# EAGLE design platine_controller (EAGLE 9.6.2)
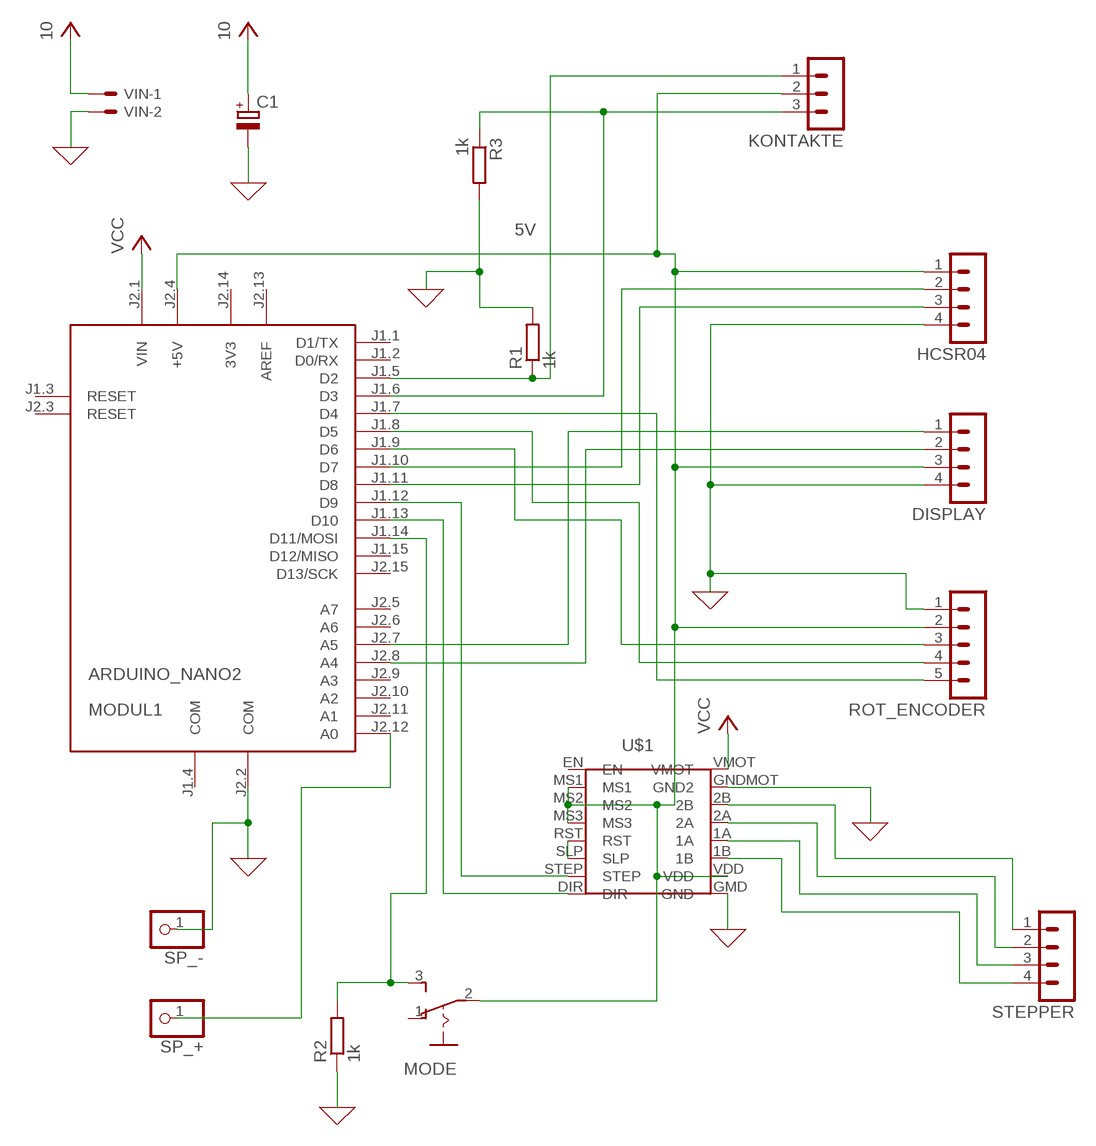
[diagram p0: schematic, sheet 1]

## Parts
C1  CPOL-EUE2,5-6E  [E2,5-6E]
DISPLAY  MA04-1  [MA04-1]
HCSR04  MA04-1  [MA04-1]
KONTAKTE  MA03-1  [MA03-1]
MODE  255SB  [255SB]
MODUL1  ARDUINO_NANO2  [ARDUINO_NANO2]
R1  1k  R-EU_0207/10  [0207/10]
R2  1k  R-EU_0207/10  [0207/10]
R3  1k  R-EU_0207/10  [0207/10]
ROT_ENCODER  MA05-1  [MA05-1]
SP_+  PINHD-1X1  [1X01]
SP_-  PINHD-1X1  [1X01]
STEPPER  MA04-1  [MA04-1]
U$1  A4988  [A4988]
VIN  22-23-2021  [22-23-2021]

## Nets
5V: DISPLAY.3 HCSR04.1 KONTAKTE.2 MODE.2(P) MODUL1.J2.4(+5V) ROT_ENCODER.2 U$1.MS1 U$1.MS2 U$1.MS3 U$1.VDD
COM: C1.- DISPLAY.4 HCSR04.4 MODUL1.J2.2(COM) R1.2 R2.1 R3.2 ROT_ENCODER.1 SP_-.1 U$1.GMD(GND) U$1.GNDMOT(GND2) VIN.2 ; supply symbol labelled GND
N$1: MODUL1.J1.7(D4) ROT_ENCODER.5
N$2: STEPPER.1 U$1.2B
N$3: MODUL1.J1.12(D9) U$1.STEP
N$4: MODUL1.J1.13(D10) U$1.DIR
N$5: U$1.RST U$1.SLP
N$6: STEPPER.2 U$1.2A
N$7: STEPPER.3 U$1.1A
N$8: STEPPER.4 U$1.1B
N$9: HCSR04.3 MODUL1.J1.11(D8)
N$10: HCSR04.2 MODUL1.J1.10(D7)
N$11: DISPLAY.1 MODUL1.J2.7(A5)
N$12: DISPLAY.2 MODUL1.J2.8(A4)
N$13: MODUL1.J1.9(D6) ROT_ENCODER.3
N$14: MODUL1.J1.8(D5) ROT_ENCODER.4
N$16: KONTAKTE.3 MODUL1.J1.6(D3) R3.1
N$17: KONTAKTE.1 MODUL1.J1.5(D2) R1.1
N$19: MODE.3(S) MODUL1.J1.14(D11/MOSI) R2.2
N$21: MODUL1.J2.12(A0) SP_+.1
VCC: C1.+ MODUL1.J2.1(VIN) U$1.VMOT VIN.1 ; supply symbol labelled 10
Unconnected: MODE.1(O) MODUL1.J1.1(D1/TX) MODUL1.J1.2(D0/RX) MODUL1.J1.3(RESET) MODUL1.J1.15(D12/MISO) MODUL1.J2.3(RESET) MODUL1.J2.5(A7) MODUL1.J2.6(A6) MODUL1.J2.9(A3) MODUL1.J2.10(A2) MODUL1.J2.11(A1) MODUL1.J2.15(D13/SCK) U$1.EN

## Power pins joined to a net without a drawn wire
3V3: MODUL1.J2.14(3V3)
AREF: MODUL1.J2.13(AREF)
COM: MODUL1.J1.4(COM)

## Library data of the parts
C1 = rcl:CPOL-EU: POLARIZED CAPACITOR, European symbol; SPICEPREFIX: C
DISPLAY HCSR04 STEPPER = con-lstb:MA04-1: PIN HEADER; OC_FARNELL: unknown; OC_NEWARK: unknown
KONTAKTE = con-lstb:MA03-1: PIN HEADER; OC_FARNELL: unknown; OC_NEWARK: unknown
MODE = switch:255SB: SLIDING SWITCH Distributor Buerklin, 11G810
MODUL1 = arduino:ARDUINO_NANO2: Arduino Nano2 Auto generated by modulcreator.ulp \;; ANZAHL: 2; MODUL: TRUE; STECKX0: -76200; STECKX1: 76200; STECKY0: 177800; STECKY1: 177800
R1-R3 = rcl:R-EU_: RESISTOR, European symbol; SPICEPREFIX: R
ROT_ENCODER = con-lstb:MA05-1: PIN HEADER; OC_FARNELL: unknown; OC_NEWARK: unknown
SP_+ SP_- = pinhead_1x1:PINHD-1X1: PIN HEADER
U$1 = A4988:A4988
VIN = con-molex:22-23-2021: .100" (2.54mm) Center Header - 2 Pin; MF: MOLEX; MPN: 22-23-2021; OC_FARNELL: 1462926; OC_NEWARK: 25C3832

## Board
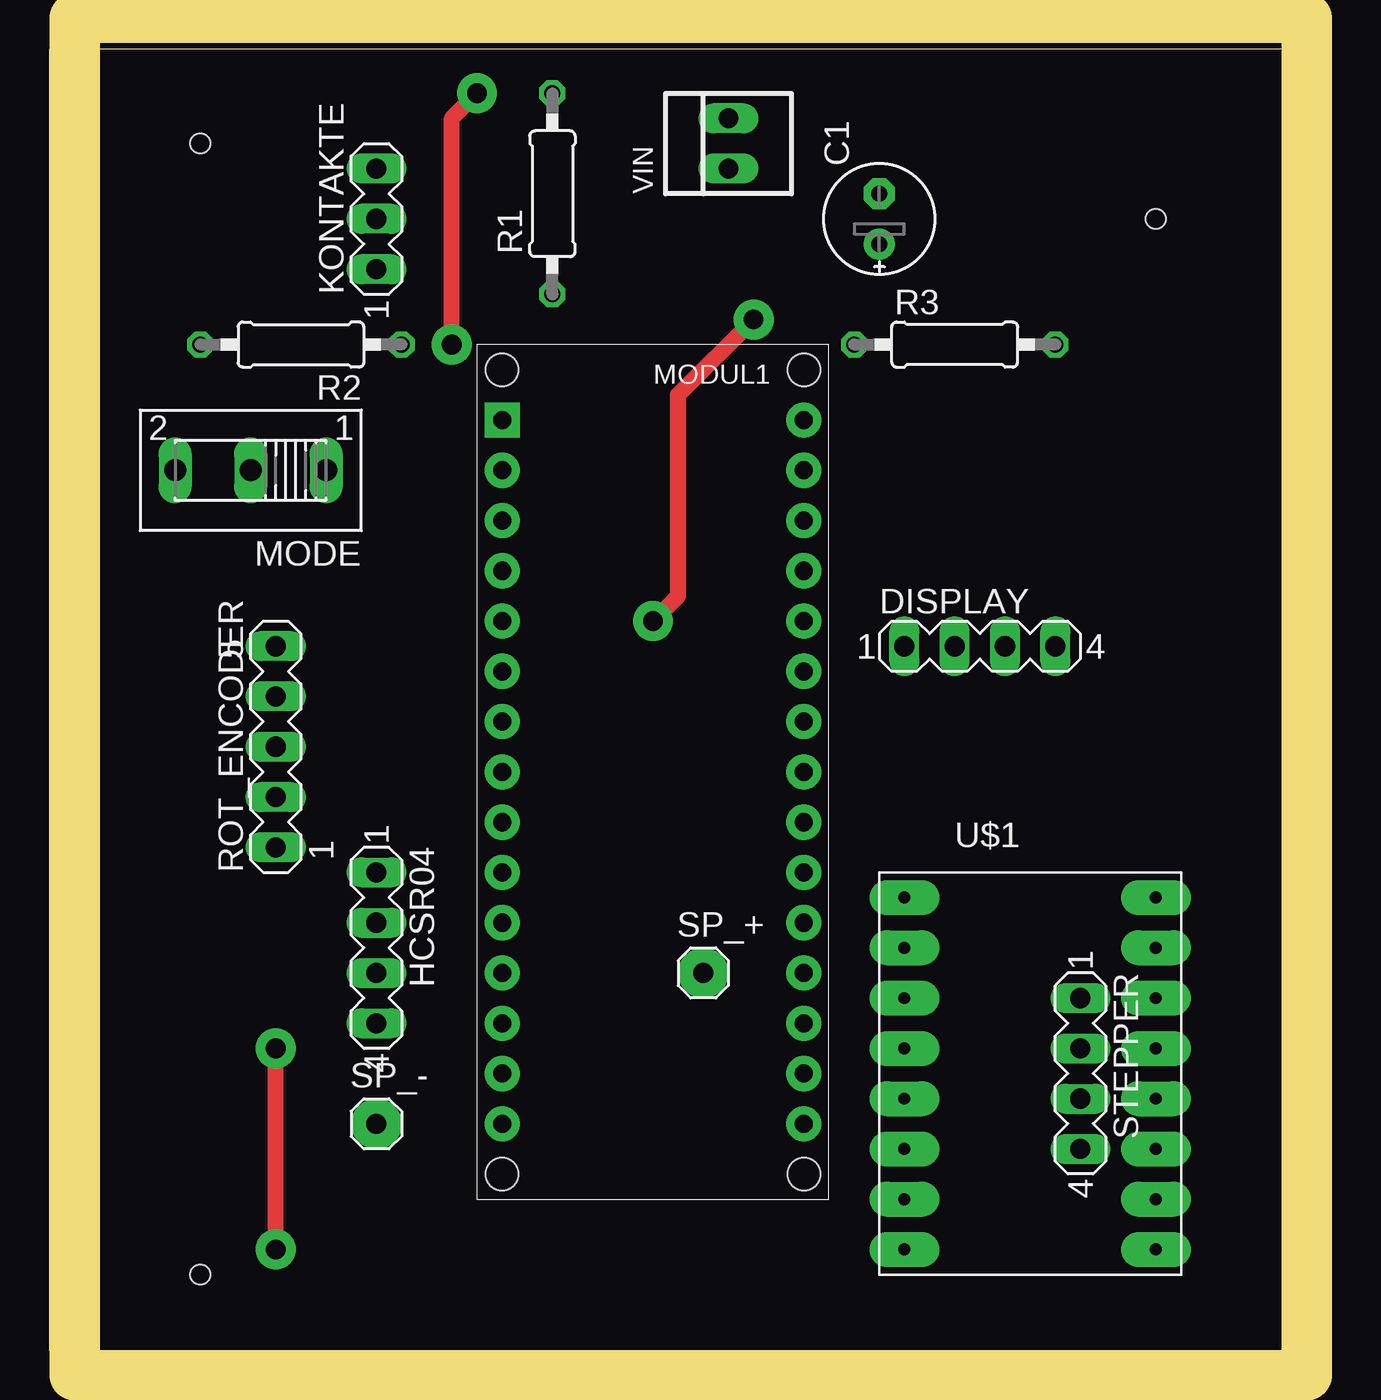
[diagram p1: board, top side]
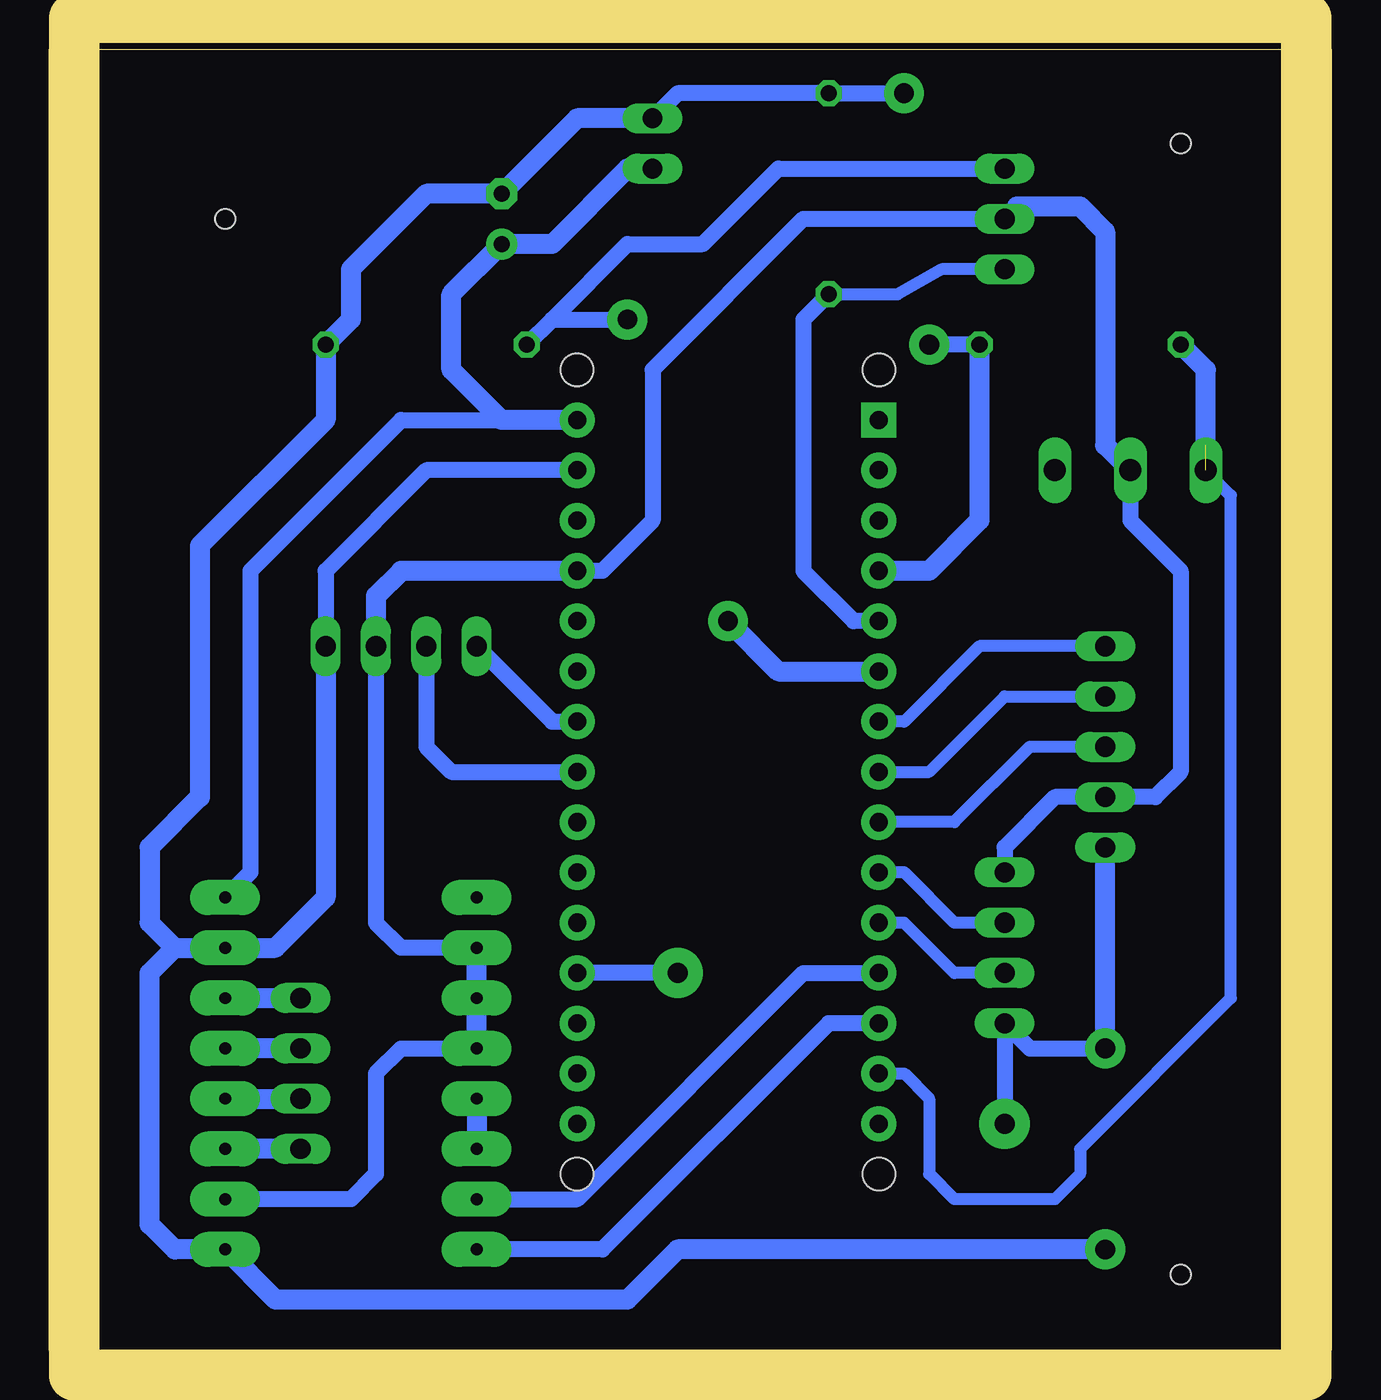
[diagram p2: board, bottom side, seen from below]

Size 64.75 x 65.71 mm. Coordinates in mm from the lower left corner, seen from the top.
Outline: 0,0 64.75,0 64.75,65.71 0,65.71 0,0
Copper layers (1*16): Top 0.035mm / dielectric 1.5mm / Bottom 0.035mm
Design rules "default *": minimum track width 6mil, minimum drill 0.35mm, track to track 6mil, track to pad 6mil, pad to pad 6mil, via to via 6mil, smd to smd 6mil, copper to edge 40mil, drill to drill 6mil, minimum pad ring 10mil, minimum via ring 20mil, stop-mask expansion 4mil, vias tented up to drill 0mil, thermal gap 10mil
Holes 1 mm at 55.88,57.15 7.62,60.96 7.62,3.81
Milling: 4 lines

### Footprints (pad centres in the part's own frame; a part is rotated, then mirrored left to right if it is on the bottom)
E2,5-6E = drill 0.813 pad 1.575: + -1.27,0 | drill 0.813 pad 1.575 octagon: - 1.27,0
MA04-1 = drill 1.016 long: 1 -3.81,0; 2 -1.27,0; 3 1.27,0; 4 3.81,0
MA03-1 = drill 1.016 long: 1 -2.54,0; 2 0,0; 3 2.54,0
255SB = drill 1.118 long: 1 -3.81,0; 2 0,0; 3 3.81,0
ARDUINO_NANO2 = drill 0.914 pad 1.778 square: J1.1 -7.62,17.78 | drill 0.914 pad 1.778: J1.2 -7.62,15.24; J1.3 -7.62,12.7; J1.4 -7.62,10.16; J1.5 -7.62,7.62; J1.6 -7.62,5.08; J1.7 -7.62,2.54; J1.8 -7.62,0; J1.9 -7.62,-2.54; J1.10 -7.62,-5.08; J1.11 -7.62,-7.62; J1.12 -7.62,-10.16; J1.13 -7.62,-12.7; J1.14 -7.62,-15.24; J1.15 -7.62,-17.78; J2.1 7.62,17.78; J2.2 7.62,15.24; J2.3 7.62,12.7; J2.4 7.62,10.16; J2.5 7.62,7.62; J2.6 7.62,5.08; J2.7 7.62,2.54; J2.8 7.62,0; J2.9 7.62,-2.54; J2.10 7.62,-5.08; J2.11 7.62,-7.62; J2.12 7.62,-10.16; J2.13 7.62,-12.7; J2.14 7.62,-15.24; J2.15 7.62,-17.78 | hole 1.651: -7.62,-20.32; 7.62,-20.32; 7.62,20.32; -7.62,20.32
0207/10 = drill 0.813 octagon: 1 -5.08,0; 2 5.08,0
MA05-1 = drill 1.016 long: 1 -5.08,0; 2 -2.54,0; 3 0,0; 4 2.54,0; 5 5.08,0
1X01 = drill 1.016 pad 2.54: 1 0,0
A4988 = drill 0.6 pad 1.778 long: 1A -1.27,8.89; 1B -1.27,6.35; 2A -1.27,11.43; 2B -1.27,13.97; DIR -13.97,1.27; EN -13.97,19.05; GMD -1.27,1.27; GNDMOT -1.27,16.51; MS1 -13.97,16.51; MS2 -13.97,13.97; MS3 -13.97,11.43; RST -13.97,8.89; SLP -13.97,6.35; STEP -13.97,3.81; VDD -1.27,3.81; VMOT -1.27,19.05
22-23-2021 = drill 1 long: 1 -1.27,0; 2 1.27,0

### Placement (x,y rotation side)
C1  41.91,57.15 90 top
DISPLAY  46.99,35.56 0 top
HCSR04  16.51,20.32 270 top
KONTAKTE  16.51,57.15 90 top
MODE  10.16,44.45 180 top
MODUL1  30.48,29.21 0 top
R1  25.4,58.42 90 top
R2  12.7,50.8 180 top
R3  45.72,50.8 0 top
ROT_ENCODER  11.43,30.48 90 top
SP_+  33.02,19.05 0 top
SP_-  16.51,11.43 0 top
STEPPER  52.07,13.97 270 top
U$1  57.15,3.81 0 top
VIN  34.29,60.96 90 top

### Tracks (layer width: path | path; a pad name or v marks a point on that pad's centre or on a via)
5V
  Bottom 0.61: KONTAKTE.2 15.88,57.78
  Bottom 0.813: U$1.MS3 46.99,15.24 48.26,13.97 48.26,8.89 49.53,7.62 U$1.VDD | DISPLAY.3 48.26,21.59 46.99,20.32 U$1.MS1 | HCSR04.1 16.51,25.4 13.97,27.94 ROT_ENCODER.2 8.89,27.94 7.62,29.21 7.62,39.37 10.16,41.91 MODE.2 | MODUL1.J2.4 36.83,39.37 34.29,41.91 34.29,49.53 26.67,57.15 KONTAKTE.2
  Bottom 1.016: U$1.MS3 U$1.MS2 U$1.MS1 | MODE.2 11.43,45.72 11.43,56.52 12.7,57.78 15.88,57.78 | MODUL1.J2.4 46.99,39.37 48.26,38.1 DISPLAY.3
COM  (via drill 1)
  Top 0.813: v20.32,50.8 20.32,62.23 v21.59,63.5 | v11.43,5.08 v11.43,15.24
  Bottom 0.813: MODUL1.J2.2 45.72,44.45 50.8,39.37 DISPLAY.4 | VIN.2 33.02,63.5 R1.2 v21.59,63.5 | R2.1 v20.32,50.8 | v11.43,15.24 15.24,15.24 HCSR04.4 SP_-.1
  Bottom 1.016: DISPLAY.4 50.8,22.86 53.34,20.32 U$1.GNDMOT 58.42,20.32 | 58.42,20.32 59.69,21.59 59.69,25.4 57.15,27.94 57.15,40.64 50.8,46.99 R3.2 49.53,52.07 49.53,54.61 45.72,58.42 C1.- 38.1,62.23 VIN.2 | 58.42,20.32 59.69,19.05 59.69,6.35 58.42,5.08 U$1.GMD 53.34,2.54 35.56,2.54 33.02,5.08 v11.43,5.08 | R2.1 17.78,41.91 20.32,39.37 MODUL1.J1.4 | v11.43,15.24 ROT_ENCODER.1
N$1
  Bottom 0.61: ROT_ENCODER.5 17.78,35.56 21.59,31.75 MODUL1.J1.7
N$2
  Bottom 0.61: 54.61,17.78 U$1.2B
  Bottom 1.016: U$1.2B STEPPER.1
N$3
  Bottom 0.813: U$1.STEP 38.1,7.62 26.67,19.05 MODUL1.J1.12
N$4
  Bottom 0.813: MODUL1.J1.13 25.4,16.51 36.83,5.08 U$1.DIR
N$5
  Bottom 1.016: U$1.RST U$1.SLP
N$6
  Bottom 0.61: 54.61,15.24 U$1.2A
  Bottom 1.016: STEPPER.2 U$1.2A
N$7
  Bottom 0.61: U$1.1A 54.61,12.7
  Bottom 1.016: U$1.1A STEPPER.3
N$8
  Bottom 0.61: 54.61,10.16 U$1.1B
  Bottom 1.016: STEPPER.4 U$1.1B
N$9
  Bottom 0.61: HCSR04.3 19.05,19.05 21.59,21.59 MODUL1.J1.11
N$10
  Bottom 0.61: HCSR04.2 19.05,21.59 21.59,24.13 MODUL1.J1.10
N$11
  Bottom 0.813: DISPLAY.1 39.37,31.75 MODUL1.J2.7
N$12
  Bottom 0.813: DISPLAY.2 45.72,30.48 44.45,29.21 MODUL1.J2.8
N$13
  Bottom 0.61: ROT_ENCODER.3 15.24,30.48 19.05,26.67 MODUL1.J1.9
N$14
  Bottom 0.61: MODUL1.J1.8 20.32,29.21 16.51,33.02 ROT_ENCODER.4
N$16  (via drill 1)
  Top 0.813: v30.48,36.83 31.75,38.1 31.75,48.26 v35.56,52.07
  Bottom 0.813: R3.1 39.37,52.07 | 39.37,52.07 35.56,55.88 31.75,55.88 27.94,59.69 KONTAKTE.3 | 39.37,52.07 v35.56,52.07
  Bottom 1.016: v30.48,36.83 27.94,34.29 MODUL1.J1.6
N$17
  Bottom 0.61: KONTAKTE.1 19.68,54.61 21.91,53.34 R1.1
  Bottom 0.813: MODUL1.J1.5 24.13,36.83 26.67,39.37 26.67,52.07 R1.1
N$19  (1 unrouted)
  Bottom 0.61: MODUL1.J1.14 21.59,13.97 20.32,12.7 20.32,8.89 19.05,7.62 13.97,7.62 12.7,8.89 12.7,10.16 5.08,17.78 5.08,43.18 MODE.3
  Bottom 1.016: 6.35,45.72 6.35,49.53 R2.2
N$21
  Bottom 0.813: SP_+.1 MODUL1.J2.12
VCC
  Bottom 0.813: U$1.VMOT 54.61,24.13 54.61,39.37 46.99,46.99 MODUL1.J2.1
  Bottom 1.016: MODUL1.J2.1 41.91,46.99 44.45,49.53 44.45,53.34 C1.+ 39.37,55.88 35.56,59.69 VIN.1